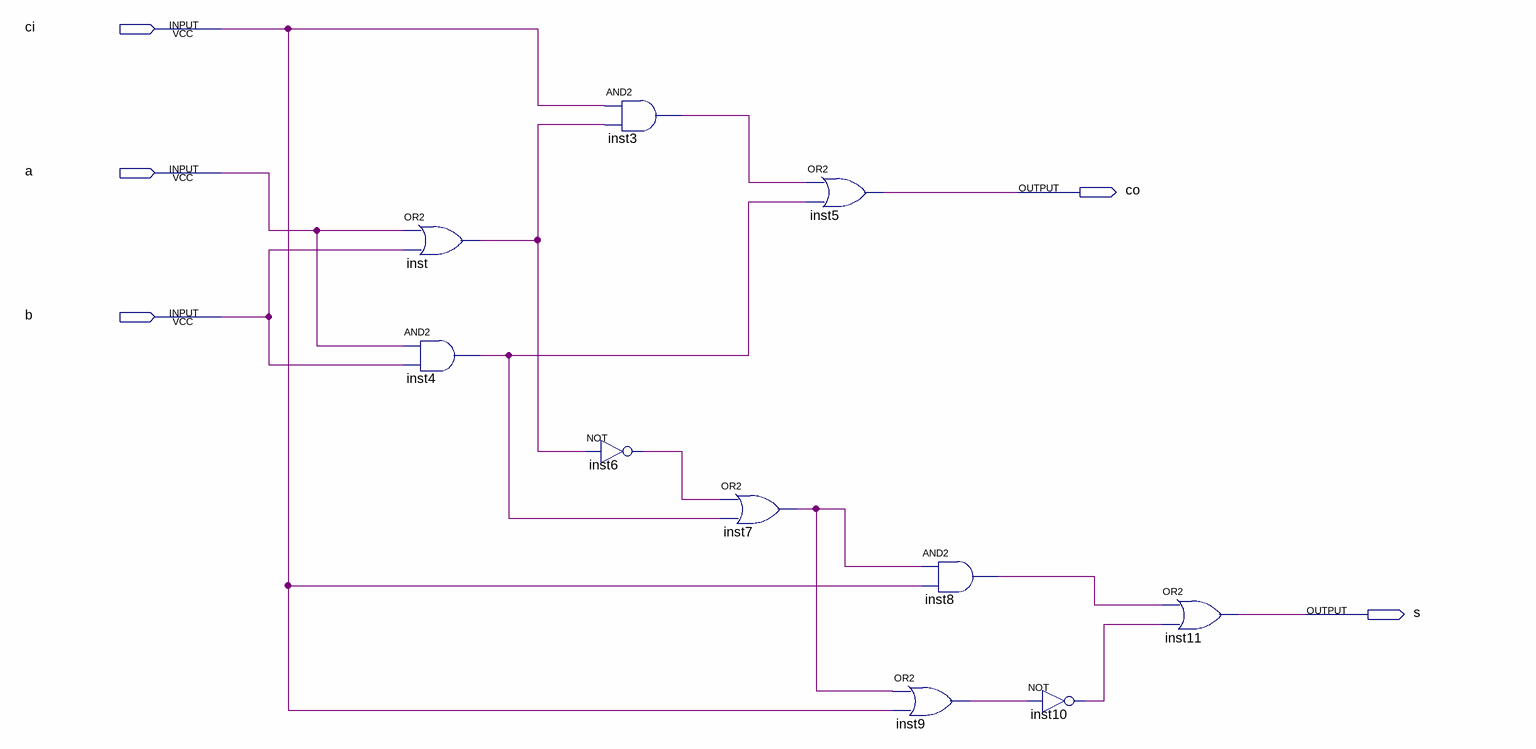
[diagram p0: schematic sheet]
// Quartus schematic OneBitAdder.bdf as structural Verilog: 10 symbols, 5 pins
module OneBitAdder (
  input  ci,
  input  a,
  input  b,
  output co,
  output s
);

  wire inst3_out, inst4_out, inst6_out, inst7_out, inst8_out, inst9_out, inst10_out, inst_out;

  or inst (inst_out, a, b);
  and inst4 (inst4_out, a, b);
  and inst3 (inst3_out, ci, inst_out);
  not inst6 (inst6_out, inst_out);
  or inst7 (inst7_out, inst6_out, inst4_out);
  or inst5 (co, inst3_out, inst4_out);
  or inst9 (inst9_out, inst7_out, ci);
  and inst8 (inst8_out, inst7_out, ci);
  not inst10 (inst10_out, inst9_out);
  or inst11 (s, inst8_out, inst10_out);
endmodule
